# Altium project HV_DAC_1PPM.PrjPcb (part 1 of 3)
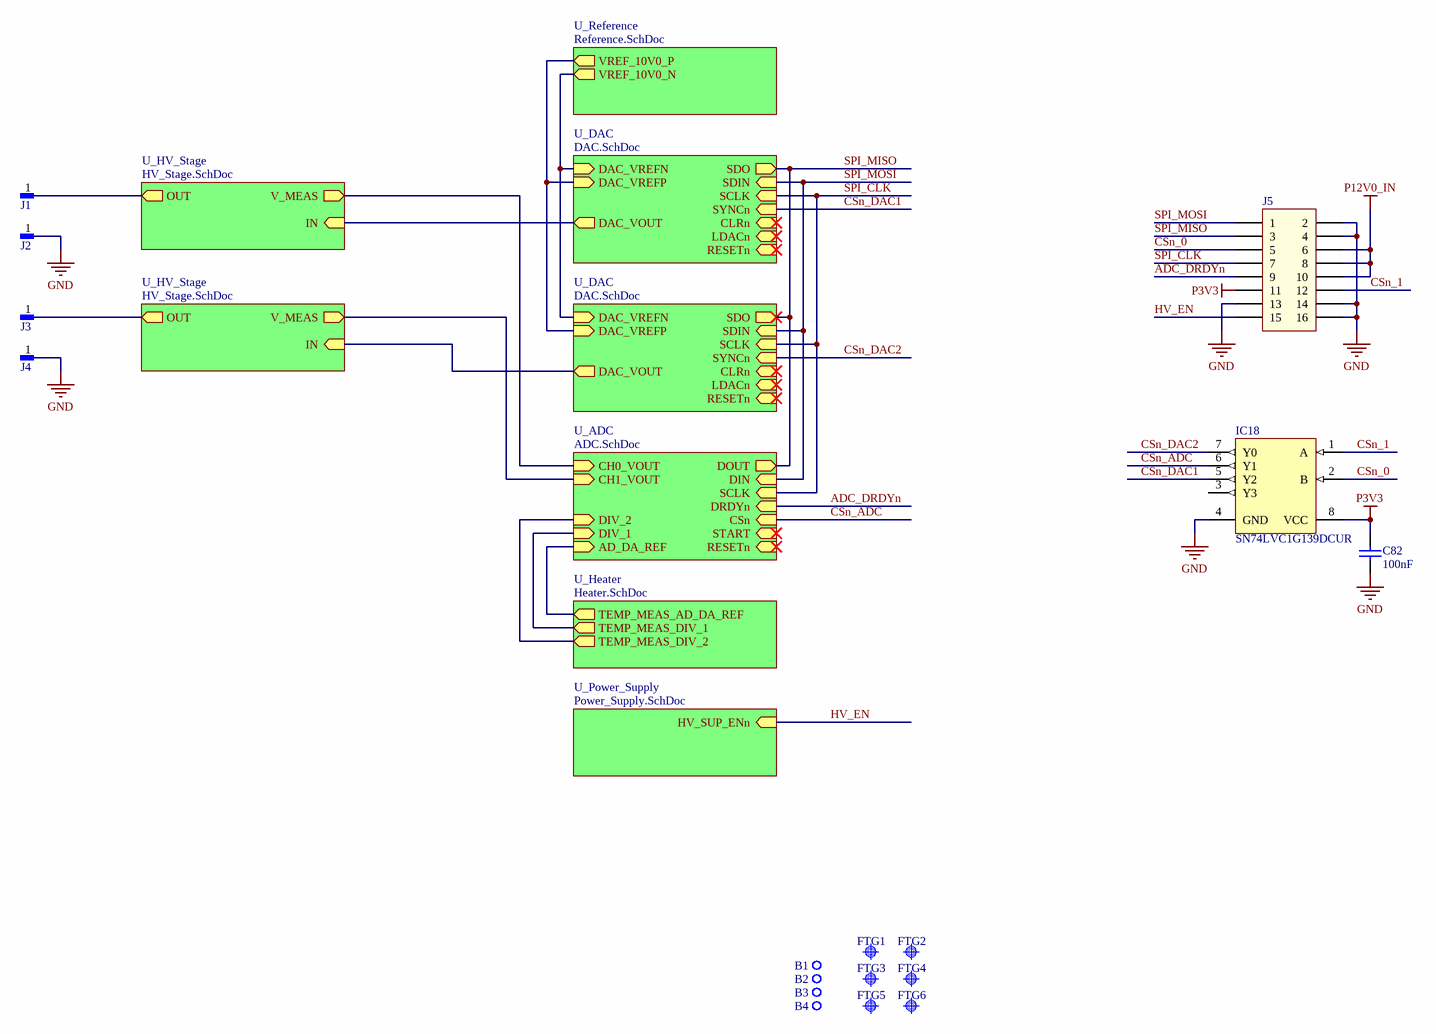
[diagram p0: HV_DAC_1PPM.SchDoc]
revision: 1.0
7 sheets, 392 parts. Net scope: hierarchical (ports join the sheet entries above them; power ports are global).
Board file: HV_DAC_1PPM.PcbDoc
Sheets:
  HV_DAC_1PPM.SchDoc
    U_ADC = ADC.SchDoc
    U_DAC = DAC.SchDoc
    U_Heater = Heater.SchDoc
    U_Power_Supply = Power_Supply.SchDoc
    U_Reference = Reference.SchDoc
    U_HV_Stage = HV_Stage.SchDoc
    U_HV_Stage = HV_Stage.SchDoc
    U_DAC = DAC.SchDoc

## Sheet HV_DAC_1PPM.SchDoc: HV DAC 1ppm
size A3; Author: M.Beldyga; CompanyName: WUT ISE; DrawnBy: M.Beldyga; Organization: WUT ISE; Address1: PW ISE; Address2: Nowowiejska 15/19 00-665 Warsaw; Address3: micbeldyga@gmail.com; SheetNumber: 1; SheetTotal: 7; ModifiedBy: -; CheckedDate: -; DivGrp: WUT ISE; Designer: M.Beldyga; ModifiedDate: -; ProjectName: Sensor Box

### Parts
B1  Plated Hole  [MTG270_500]  (value not drawn)  (no BOM)
B2  Plated Hole  [MTG270_500]  (value not drawn)  (no BOM)
B3  Plated Hole  [MTG270_500]  (value not drawn)  (no BOM)
B4  Plated Hole  [MTG270_500]  (value not drawn)  (no BOM)
C82  100nF  [CAPC1005X55N]
FTG1  Use only in PCB  [FIDUCIAL_TOP_S100-200]  (value not drawn)  (no BOM)
FTG2  Use only in PCB  [FIDUCIAL_TOP_S100-200]  (value not drawn)  (no BOM)
FTG3  Use only in PCB  [FIDUCIAL_TOP_S100-200]  (value not drawn)  (no BOM)
FTG4  Use only in PCB  [FIDUCIAL_TOP_S100-200]  (value not drawn)  (no BOM)
FTG5  Use only in PCB  [FIDUCIAL_TOP_S100-200]  (value not drawn)  (no BOM)
FTG6  Use only in PCB  [FIDUCIAL_TOP_S100-200]  (value not drawn)  (no BOM)
IC18  SN74LVC1G139DCUR  [TSSOP50P310X90-8N]
J1  SMD Pad  [R400X300]  (value not drawn)
J2  SMD Pad  [R400X300]  (value not drawn)
J3  SMD Pad  [R400X300]  (value not drawn)
J4  SMD Pad  [R400X300]  (value not drawn)
J5  2.00 mm_SMT_Vertical_16 pin  [62131621821]  (value not drawn)

### Sub-sheets
U_ADC = ADC.SchDoc: SCLK (in), DIN (in), DRDYn (in), DOUT (out), CSn (in), START (in), RESETn (in), CH0_VOUT (in), CH1_VOUT (in), AD_DA_REF (in), DIV_1 (in), DIV_2 (in)
U_DAC = DAC.SchDoc: SDIN (in), SCLK (in), SYNCn (in), SDO (out), CLRn (in), LDACn (in), RESETn (in), DAC_VREFN (in), DAC_VREFP (in), DAC_VOUT (out)
U_DAC = DAC.SchDoc: SDIN (in), SCLK (in), SYNCn (in), SDO (out), CLRn (in), LDACn (in), RESETn (in), DAC_VREFN (in), DAC_VREFP (in), DAC_VOUT (out)
U_Heater = Heater.SchDoc: TEMP_MEAS_AD_DA_REF (out), TEMP_MEAS_DIV_1 (out), TEMP_MEAS_DIV_2 (out)
U_HV_Stage = HV_Stage.SchDoc: IN (in), OUT (out), V_MEAS (out)
U_HV_Stage = HV_Stage.SchDoc: IN (in), OUT (out), V_MEAS (out)
U_Power_Supply = Power_Supply.SchDoc: HV_SUP_ENn (in)
U_Reference = Reference.SchDoc: VREF_10V0_P (out), VREF_10V0_N (out)

### Nets
GND: C82.1 IC18.4(GND) J2.1 J4.1 J5.2 J5.4 J5.13 J5.14 J5.16
P3V3: C82.2 IC18.8(VCC) J5.11
P12V0_IN: J5.6 J5.8 J5.10
ADC_AIN0: sheet U_ADC/DIV_1, sheet U_Heater/TEMP_MEAS_DIV_1
ADC_AIN1: sheet U_ADC/CH1_VOUT, sheet U_HV_Stage/V_MEAS
ADC_AIN4: sheet U_ADC/CH0_VOUT, sheet U_HV_Stage/V_MEAS
ADC_AIN5: sheet U_ADC/AD_DA_REF, sheet U_Heater/TEMP_MEAS_AD_DA_REF
ADC_AIN6: sheet U_ADC/DIV_2, sheet U_Heater/TEMP_MEAS_DIV_2
ADC_DRDYn: J5.9 ; sheet U_ADC/DRDYn
CSn_0: IC18.2(B) J5.5
CSn_1: IC18.1(A) J5.12
CSn_ADC: IC18.6(Y1) ; sheet U_ADC/CSn
CSn_DAC1: IC18.5(Y2) ; sheet U_DAC/SYNCn
CSn_DAC2: IC18.7(Y0) ; sheet U_DAC/SYNCn
DAC_RFB: sheet U_DAC/DAC_VOUT, sheet U_HV_Stage/IN
DAC_RFB: sheet U_HV_Stage/IN, sheet U_DAC/DAC_VOUT  [a separate net that carries the same name]
HV_EN: J5.15 ; sheet U_Power_Supply/HV_SUP_ENn
HV_OUT: J1.1 ; sheet U_HV_Stage/OUT
HV_OUT: J3.1 ; sheet U_HV_Stage/OUT  [a separate net that carries the same name]
SPI_CLK: J5.7 ; sheet U_ADC/SCLK, sheet U_DAC/SCLK, sheet U_DAC/SCLK
SPI_MISO: J5.3 ; sheet U_ADC/DOUT, sheet U_DAC/SDO, sheet U_DAC/SDO
SPI_MOSI: J5.1 ; sheet U_ADC/DIN, sheet U_DAC/SDIN, sheet U_DAC/SDIN
VREF_10V0_N: sheet U_DAC/DAC_VREFN, sheet U_Reference/VREF_10V0_N, sheet U_DAC/DAC_VREFN
VREF_10V0_P: sheet U_DAC/DAC_VREFP, sheet U_Reference/VREF_10V0_P, sheet U_DAC/DAC_VREFP

Not connected (* = marked no-connect by the designer): B1 1; B2 1; B3 1; B4 1; IC18 3(Y3)

### Notes on the sheet
- Project/Equipment
- Document
- Designer
- Drawn by
- Check.by
- Contact
- File
- Last Mod.
- Print Date
- Sheet
- Size
- A3
- of
- Rev

### Library data of the parts
B1-B4 = PLATED_HOLE2.7_PAD5.0: Single Terminal Socket; Part Description: Plated Through Hole: Hole Dia.=2.7mm Pad Dia.=5.0mm; Mounted: No; Part Number: PLATED_HOLE2.7_PAD5.0; Component Type: Standard (No BOM); Pin Count: 1; Family: Plated Hole; Socket: No; SMD: No; Sense: No; Status: None; ComponentHeight: 0mm; HelpURL: Undefined; Author: CERN DEM JMW; CreateDate: 27.09.2011; LatestRevisionDate: 27.09.2011; PackageDescription: Plated Through Hole: Hole Dia.=2.7mm Pad Dia.=5.0mm
C82 = CC0402_100NF_50V_10%_X7R: Non-polarised capacitor; Part Description: SMD Multilayer Chip Ceramic Capacitor; Manufacturer: GENERIC; Manufacturer1 Part Number: GRM155R71H104KE14D; Voltage: 50V; TC: X7R; Tolerance: ±10%; Part Number: CC0402_100NF_50V_10%_X7R; Component Kind: Standard; Component Type: Standard; Pin Count: 2; Value: 100nF; Status: None; Manufacturer Part Number: CC0402_100NF_50V_10%_X7R; Case: 0402; Mounted: Yes; Socket: No; SMD: Yes; Sense: No; Manufacturer1 Example: MURATA; Manufacturer1 ComponentHeight: 0.55mm; HelpURL: \\cern.ch\dfs\Applications\Altium\Datasheets\CC0402_MURATA_GRM155R71H104KE14D.pdf; Author: CERN DEM MR; CreateDate: 6/30/2017; LatestRevisionDate: 6/30/2017
FTG1-FTG6 = FIDUCIAL_TARGET_S100-200: Fiducial Target; Part Description: Square Fiducial Target, Top Layer, 1.0mm, Top Solder 2.0mm, Keepout =2.0mm; Mounted: No; Part Number: FIDUCIAL_TARGET_S100-200; Component Type: Standard (No BOM); Pin Count: 1; Family: Fiducial; Socket: No; SMD: Yes; Sense: No; Status: None; ComponentHeight: 0mm; HelpURL: Undefined; Author: CERN DEM JLC; CreateDate: 09.02.2010; LatestRevisionDate: 04.04.2012; PackageDescription: Square Fiducial Target, Top Layer, 1.0mm, Top Solder 2.0mm, Keepout =2.0mm
IC18 = SN74LVC1G139DCUR: IC DECODER/DEMUX 1X2: 4 8VSSOP Decoder/Demultiplexer 1 x 2: 4 8-VSSOP; Manufacturer: Texas Instruments; Number of Outputs: 4; Number of Bits: 1; Logic Function: Decoder,Demultiplexer; Number of Inputs: 2; Propagation Delay: 16.7ns; Max Supply Voltage: 5.5V; Min Supply Voltage: 1.65V; High Level Output Current: 32mA; Polarity: Inverting; Quiescent Current: 10uA; Supply Type: Single; Throw Configuration: 4340Throw Configuration; Number of Channels: 1NUMBER; Supplier: Mouser; Supplier Part Number: 595-SN74LVC1G139DCUR; Manufacturer Part Number: SN74LVC1G139DCUR; RoHS: Yes; Category: Integrated Circuits (ICs); Stock: 29396; Pricing: 1=0.38, 10=0.261, 50=0.235, 100=0.207, 1000=0.178, 10000=0.158 (USD); Mounting Technology: Surface Mount; Case/Package: VSSOP; Pins: 8; Weight: 0.000339oz; Min Operating Temperature: -40°C; Max Operating Temperature: 85°C; Packaging: Tape and Reel; Number of Circuits: 1; Number of Elements: 1; Low Level Output Current: 32mA; Number of Input Lines: 2; Number of Output Lines: 4; Independent Circuits: 1; Series: 74LVC; Technology: CMOS; Length: 2.3mm; Width: 2mm; Height: 900um; Thickness: 850um; Reach SVHC Compliant: No; Lead Free: 5697LeadFree; RoHS Compliant: Yes; ComponentLink1URL: https://datasheet.ciiva.com/1888/sn74lvc1g139-1888859.pdf?src-supplier=Digikey; ComponentLink1Description: https://datasheet.ciiva.com/1888/sn74lvc1g139-1888859.pdf?src-supplier=Digikey; ComponentLink2URL: https://datasheet.ciiva.com/1888/sn74lvc1g139-1888860.pdf?src-supplier=Digikey; ComponentLink2Description: https://datasheet.ciiva.com/1888/sn74lvc1g139-1888860.pdf?src-supplier=Digikey; ComponentLink3URL: https://datasheet.ciiva.com/14293/sn74lvc1g139-14293589.pdf?src-supplier=Avnet; ComponentLink3Description: https://datasheet.ciiva.com/14293/sn74lvc1g139-14293589.pdf?src-supplier=Avnet; ComponentLink4URL: https://datasheet.ciiva.com/14294/sn74lvc1g139-14294935.pdf?src-supplier=Avnet; ComponentLink4Description: https://datasheet.ciiva.com/14294/sn74lvc1g139-14294935.pdf?src-supplier=Avnet; ComponentLink5URL: https://datasheet.ciiva.com/46430/1847422-46430989.pdf?src-supplier=Element14; ComponentLink5Description: https://datasheet.ciiva.com/46430/1847422-46430989.pdf?src-supplier=Element14
J1-J4 = SMD_PAD_4X3MM: Pad; Part Description: 4mm x 3mm SMD Pad; Mounted: No; Part Number: SMD_PAD_4X3MM; Component Kind: Standard (No BOM); Component Type: Standard (No BOM); Pin Count: 1; Family: SMD Pad; Socket: No; SMD: Yes; Sense: No; Status: None; ComponentHeight: 0mm; HelpURL: Undefined; Author: CERN DEM JLC; CreateDate: 3/15/2010; LatestRevisionDate: 3/15/2010; PackageDescription: 4mm x  3mm SMD Pad
J5 = 62131621821: Socket Header WR-PHD, Pitch 2.00 mm, SMT, Vertical, dual row, 16 pin; Rated Current: 2 A; Pin Number: 16; Pitch: 2.00 mm; Working Voltage: 200 VAC; Contact Resistance: 20 mOhm; Insulation Resistance: >1000 MOhm; ComponentLink1Description: Manufacturer; ComponentLink1URL: http://www.we-online.de; ComponentLink2Description: Datasheet; ComponentLink2URL: http://katalog.we-online.com/em/datasheet/62131621821.pdf; Part Number: 62131621821; Published Date: Jan. 2018; Publisher: Wurth Elektronik; Operating Temperature: -40 to 105 degC; Mounting Technology: SMT; Row Number: dual; Orientation: Vertical

## Sheet ADC.SchDoc: ADC
size A3; Author: M.Beldyga; CompanyName: WUT ISE; DrawnBy: M.Beldyga; Organization: WUT ISE; Address1: PW ISE; Address2: Nowowiejska 15/19 00-665 Warsaw; Address3: micbeldyga@gmail.com; SheetNumber: 4; SheetTotal: 7; ModifiedBy: -; CheckedDate: -; Title2: 2ksps 24b; DivGrp: WUT ISE; Designer: M.Beldyga; ModifiedDate: -; ProjectName: Sensor Box
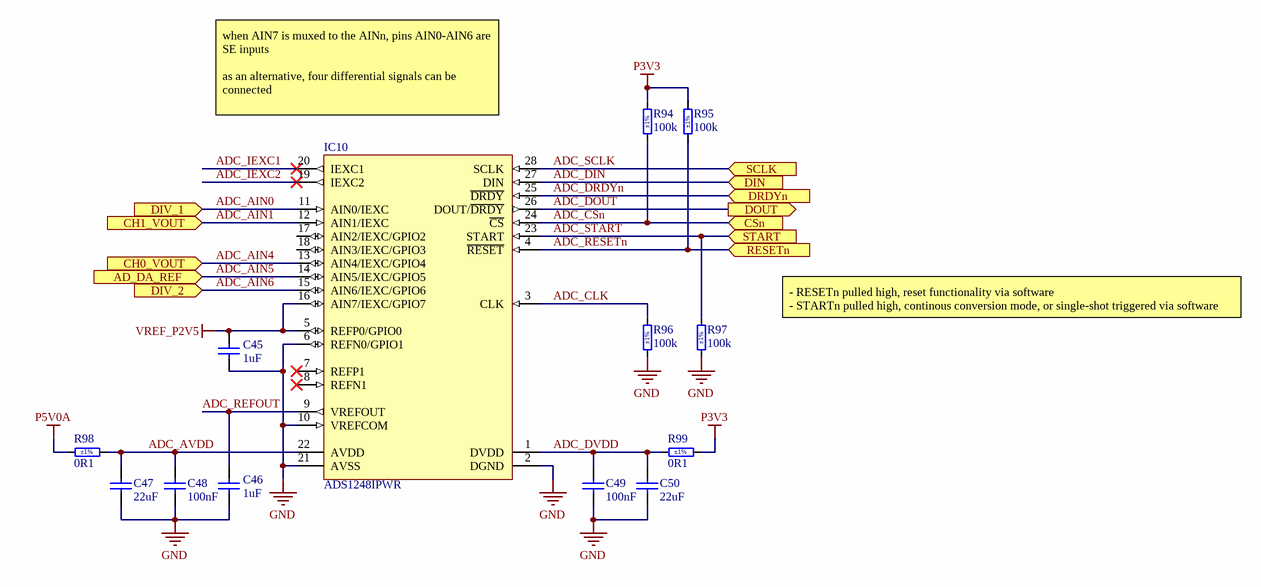
[diagram p1: ADC.SchDoc]

### Parts
C45  1uF  [CAPC1005X55N]
C46  1uF  [CAPC1005X55N]
C47  22uF  [CAPC3216X180N]
C48  100nF  [CAPC1005X55N]
C49  100nF  [CAPC1005X55N]
C50  22uF  [CAPC3216X180N]
IC10  ADS1248IPWR  [SOP65P640X120-28N]
R94  100k  Tolerance: ±1%  [RESC1005X40N]
R95  100k  Tolerance: ±1%  [RESC1005X40N]
R96  100k  Tolerance: ±1%  [RESC1005X40N]
R97  100k  Tolerance: ±1%  [RESC1005X40N]
R98  0R1  Tolerance: ±1%  [RESC1608X55N]
R99  0R1  Tolerance: ±1%  [RESC1608X55N]

### Ports
AD_DA_REF (in), CH0_VOUT (in), CH1_VOUT (in), CSn (in), DIN (in), DIV_1 (in), DIV_2 (in), DOUT (out), DRDYn (in), RESETn (in), SCLK (in), START (in)

### Nets
GND: C45.1 C46.1 C47.1 C48.1 C49.1 C50.1 IC10.2(DGND) IC10.6(REFN0/GPIO1) IC10.10(VREFCOM) IC10.21(AVSS) R96.1 R97.1
P3V3: R94.2 R95.2 R99.1
P5V0A: R98.2
VREF_P2V5: C45.2 IC10.5(REFP0/GPIO0) IC10.16(AIN7/IEXC/GPIO7)
ADC_AIN0: IC10.11(AIN0/IEXC) ; port DIV_1
ADC_AIN1: IC10.12(AIN1/IEXC) ; port CH1_VOUT
ADC_AIN4: IC10.13(AIN4/IEXC/GPIO4) ; port CH0_VOUT
ADC_AIN5: IC10.14(AIN5/IEXC/GPIO5) ; port AD_DA_REF
ADC_AIN6: IC10.15(AIN6/IEXC/GPIO6) ; port DIV_2
ADC_AVDD: C47.2 C48.2 IC10.22(AVDD) R98.1
ADC_CLK: IC10.3(CLK) R96.2
ADC_CSn: IC10.24(~{CS}) R94.1 ; port CSn  [project net CSn_ADC]
ADC_DIN: IC10.27(DIN) ; port DIN  [project net SPI_MOSI]
ADC_DOUT: IC10.26(DOUT/~{DRDY}) ; port DOUT  [project net SPI_MISO]
ADC_DRDYn: IC10.25(~{DRDY}) ; port DRDYn
ADC_DVDD: C49.2 C50.2 IC10.1(DVDD) R99.2
ADC_IEXC1: IC10.20(IEXC1)
ADC_IEXC2: IC10.19(IEXC2)
ADC_REFOUT: C46.2 IC10.9(VREFOUT)
ADC_RESETn: IC10.4(~{RESET}) R95.1 ; port RESETn
ADC_SCLK: IC10.28(SCLK) ; port SCLK  [project net SPI_CLK]
ADC_START: IC10.23(START) R97.2 ; port START

Not connected (* = marked no-connect by the designer): IC10 7(REFP1)* 8(REFN1)* 17(AIN2/IEXC/GPIO2) 18(AIN3/IEXC/GPIO3)

### Notes on the sheet
- when AIN7 is muxed to the AINn, pins AIN0-AIN6 are SE inputs
  as an alternative, four differential signals can be connected
- - RESETn pulled high, reset functionality via software
  - STARTn pulled high, continous conversion mode, or single-shot triggered via software
- Project/Equipment
- Document
- Designer
- Drawn by
- Check.by
- Contact
- File
- Last Mod.
- Print Date
- Sheet
- Size
- A3
- of
- Rev

### Library data of the parts
C45 C46 = CC0402_1UF_16V_10%_X5R: Non-polarised capacitor; Part Description: SMD Multilayer Chip Ceramic Capacitor; Manufacturer: GENERIC; Manufacturer1 Part Number: C1005X5R1C105KT; Voltage: 16V; TC: X5R; Tolerance: ±10%; Part Number: CC0402_1UF_16V_10%_X5R; Component Kind: Standard; Component Type: Standard; Pin Count: 2; Value: 1uF; Status: Preferred; Manufacturer Part Number: CC0402_1UF_16V_10%_X5R; Case: 0402; Mounted: Yes; Socket: No; SMD: Yes; Sense: No; Manufacturer1 Example: TDK; Manufacturer1 ComponentHeight: 0.55mm; HelpURL: \\cern.ch\dfs\Applications\Altium\Datasheets\CC0402_X5R_TDK_C.pdf; Author: CERN DEM JLC; CreateDate: 25.10.2012; LatestRevisionDate: 25.10.2012
C47 C50 = CC1206_22UF_25V_20%_X5R: Non-polarised capacitor; Part Description: SMD Multilayer Chip Ceramic Capacitor; Manufacturer: GENERIC; Manufacturer1 Part Number: C3216X5R1E226M160; Voltage: 25V; TC: X5R; Tolerance: ±20%; Part Number: CC1206_22UF_25V_20%_X5R; Component Kind: Standard; Component Type: Standard; Pin Count: 2; Value: 22uF; Status: None; Manufacturer Part Number: CC1206_22UF_25V_20%_X5R; Case: 1206; Mounted: Yes; Socket: No; SMD: Yes; Sense: No; Manufacturer1 Example: TDK; Manufacturer1 ComponentHeight: 1.8mm; HelpURL: \\cern.ch\dfs\Applications\Altium\Datasheets\CC1206_X5R_TDK_C.pdf; Author: CERN DEM WB; CreateDate: 7/25/2018; LatestRevisionDate: 7/25/2018
C48 C49 = CC0402_100NF_50V_10%_X7R: as C82 on sheet HV_DAC_1PPM; Part Number: CC0402_100NF_50V_10%_X7R; Component Kind: Standard; Component Type: Standard; Pin Count: 2; Value: 100nF; Status: None; Manufacturer Part Number: CC0402_100NF_50V_10%_X7R; Case: 0402; Mounted: Yes; Socket: No; SMD: Yes; Sense: No; Manufacturer1 Example: MURATA; Manufacturer1 ComponentHeight: 0.55mm; HelpURL: \\cern.ch\dfs\Applications\Altium\Datasheets\CC0402_MURATA_GRM155R71H104KE14D.pdf; Author: CERN DEM MR; CreateDate: 6/30/2017; LatestRevisionDate: 6/30/2017
IC10 = ADS1248IPWR: 24-Bit Analog-to-Digital Converter for Temperature Sensors; Manufacturer: TEXAS INSTRUMENTS; PressFit: No; Bonding: No; Part Number: ADS1248IPWR; Component Kind: Standard; Component Type: Standard; Device: ADS1248IPWR; PackageDescription: SOP, 0.65mm Pitch; 28 Pin, 4.40mm W X 9.70mm L X 1.20mm H body, IPC Medium Density; Part Description: 24-Bit Analog-to-Digital Converter for Temperature Sensors; Manufacturer Part Number: ADS1248IPWR; Pin Count: 28; Case: TSSOP28; Mounted: Yes; Socket: No; SMD: Yes; Sense: No; ComponentHeight: 1.2mm; Author: CERN DEM JLC; HelpURL: \\cern.ch\dfs\Applications\Altium\Datasheets\ADS1248IPWR.pdf; CreateDate: 3/19/2012; LatestRevisionDate: 3/19/2012
R94-R97 = R0402_100K_1%_0.0625W_100PPM: Resistor - 1%; Part Description: General Purpose Thick Film Chip Resistor; Manufacturer: GENERIC; Manufacturer1 Part Number: 232270671004L; TC: ±100ppm/°C; PressFit: No; Part Number: R0402_100K_1%_0.0625W_100PPM; Component Kind: Standard; Component Type: Standard; Pin Count: 2; Value: 100k; Status: Not Recommended; Power: 0.0625W; Manufacturer Part Number: R0402_100K_1%_0.0625W_100PPM; Case: 0402; Mounted: Yes; Sense: No; Socket: No; SMD: Yes; Manufacturer1 Example: YAGEO PHYCOMP; Manufacturer1 ComponentHeight: 0.4mm; HelpURL: \\cern.ch\dfs\Applications\Altium\Datasheets\R0402_Phycomp_RC0402.pdf; Author: CERN DEM JLC; CreateDate: 12/3/2007; LatestRevisionDate: 10/17/2012
R98 R99 = R0603_0R1_1%_0.1W_200PPM: Resistor - 1%; Part Description: Low Value Chip Resistor; Manufacturer: GENERIC; Manufacturer1 Part Number: CRL0603-FW-R100ELF; Power: 0.1W; TC: ±200ppm/°C; PressFit: No; Part Number: R0603_0R1_1%_0.1W_200PPM; Component Kind: Standard; Component Type: Standard; Pin Count: 2; Value: 0R1; Status: Preferred; Manufacturer Part Number: R0603_0R1_1%_0.1W_200PPM; Case: 0603; Mounted: Yes; Sense: No; Socket: No; SMD: Yes; Manufacturer1 Example: BOURNS; Manufacturer1 ComponentHeight: 0.55mm; HelpURL: \\cern.ch\dfs\Applications\Altium\Datasheets\R0603_BOURNS_CRL.pdf; Author: CERN DEM JMW; CreateDate: 11/26/2019; LatestRevisionDate: 11/26/2019

## Sheet DAC.SchDoc: DAC
size A3; Author: M.Beldyga; CompanyName: WUT ISE; DrawnBy: M.Beldyga; Organization: WUT ISE; Address1: PW ISE; Address2: Nowowiejska 15/19 00-665 Warsaw; Address3: micbeldyga@gmail.com; SheetNumber: 6; SheetTotal: 7; ModifiedBy: -; CheckedDate: -; Title2: 1 ppm 20b; DivGrp: WUT ISE; Designer: M.Beldyga; ModifiedDate: -; ProjectName: Sensor Box
Used 2 times, as channels U_DAC, U_DAC. Parts and nets are listed once, with the designators drawn on the sheet.
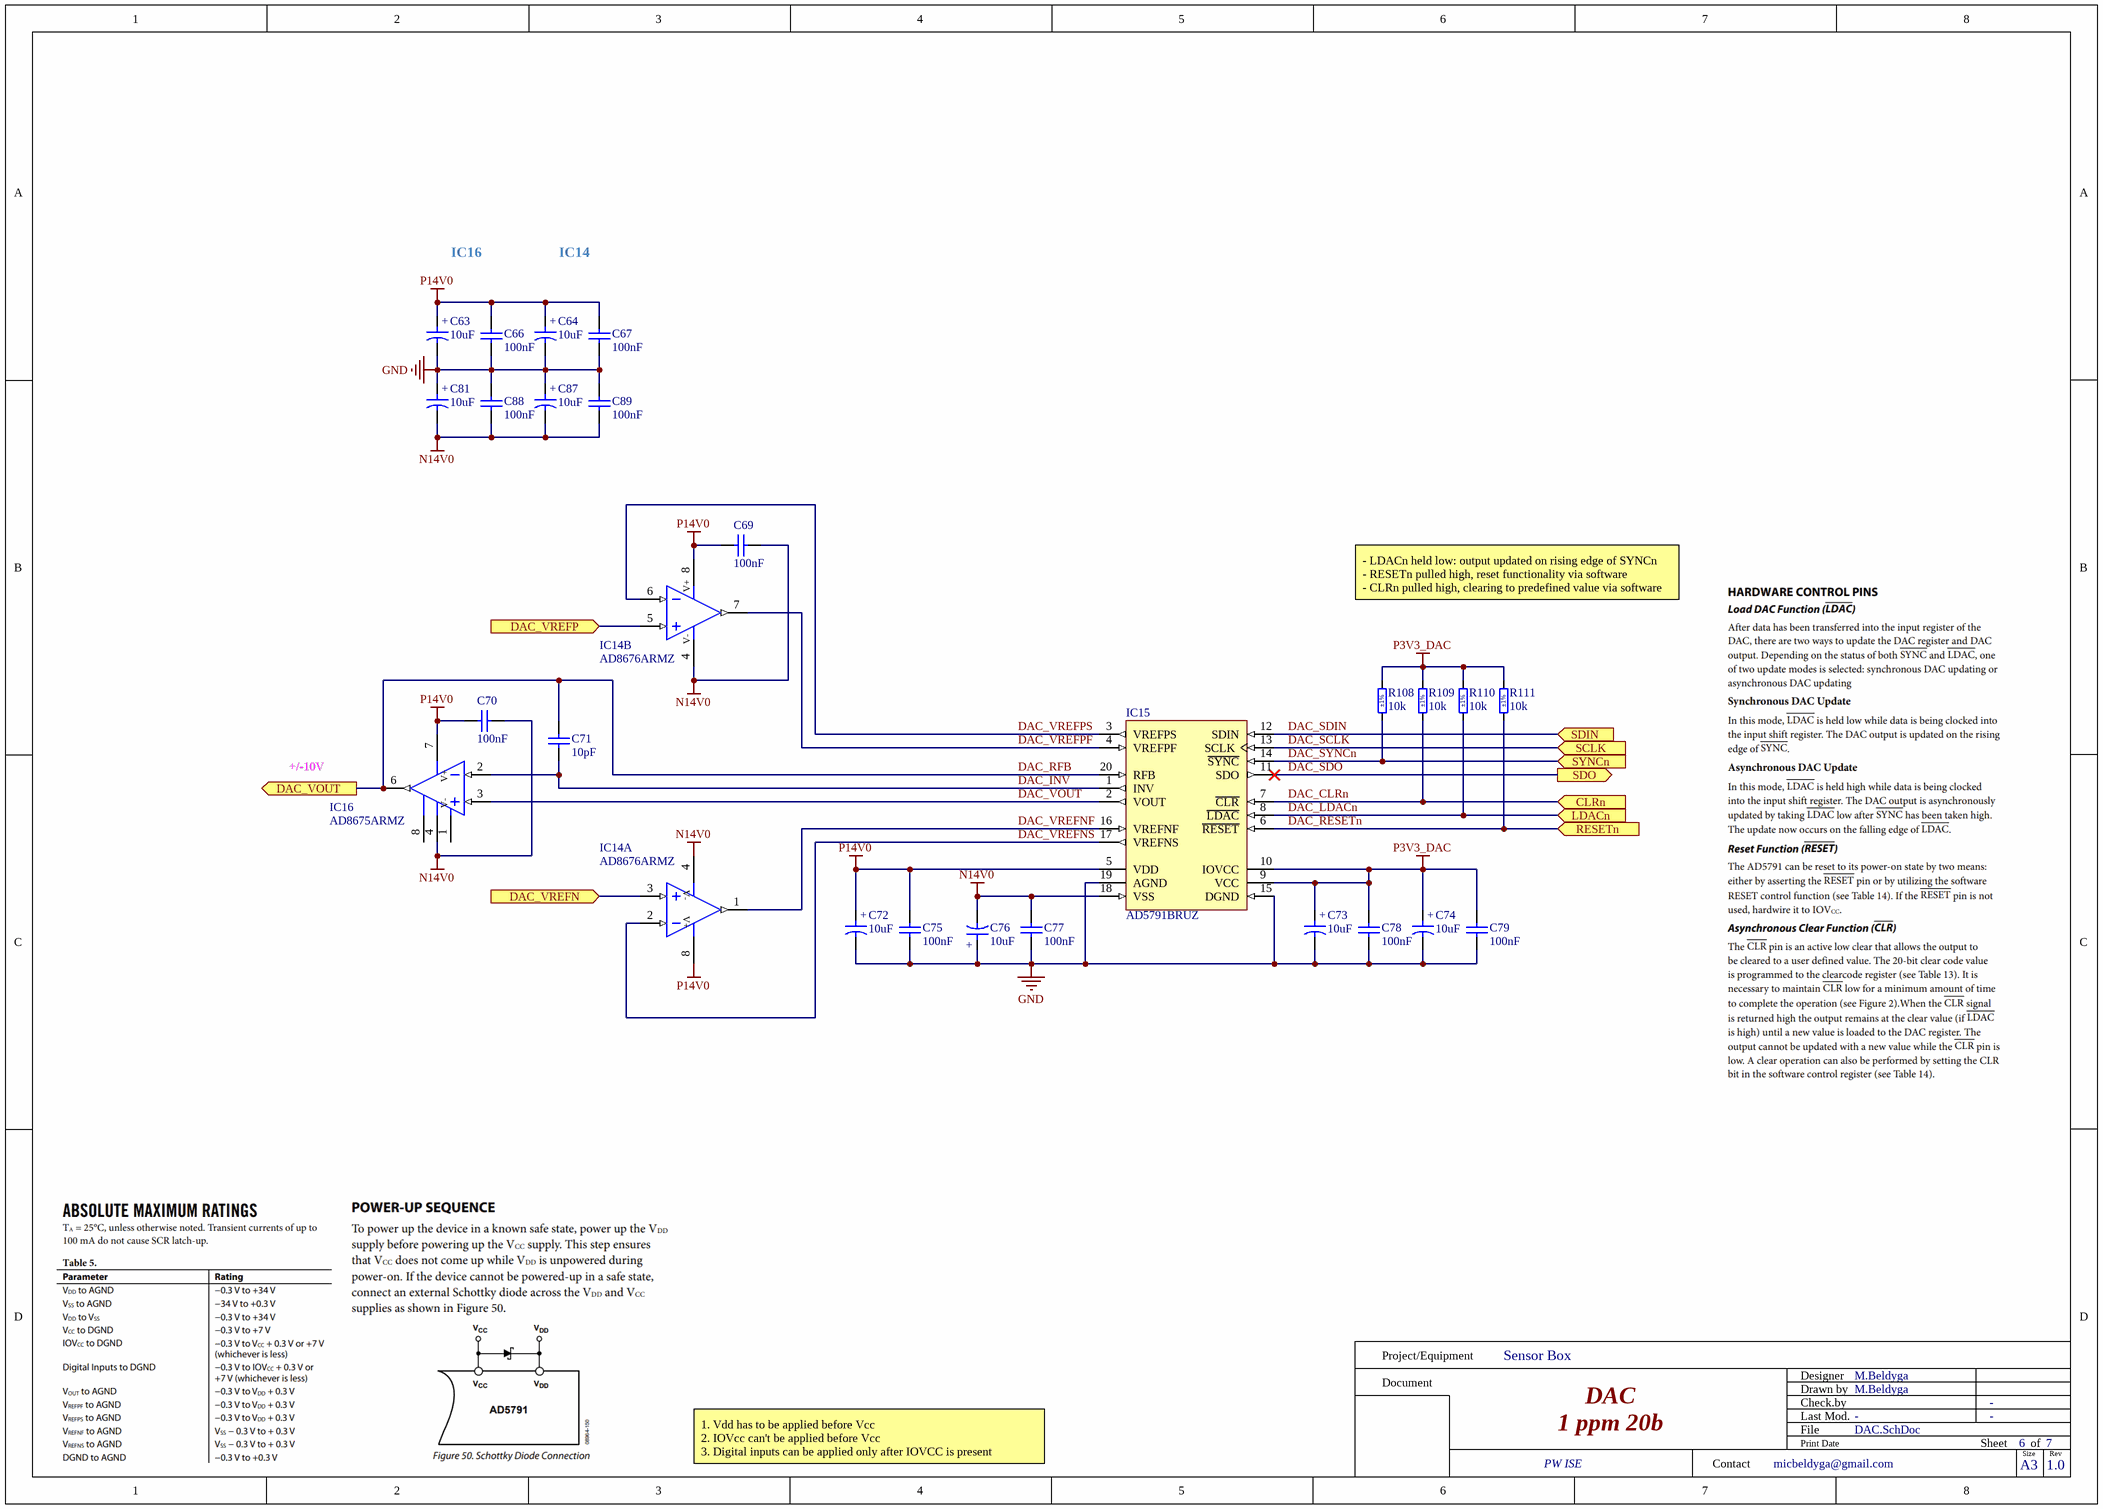
[diagram p2: DAC.SchDoc]

### Parts
C63  10uF  [CAPMP3216X180N]
C64  10uF  [CAPMP3216X180N]
C66  100nF  [CAPC1005X55N]
C67  100nF  [CAPC1005X55N]
C69  100nF  [CAPC1005X55N]
C70  100nF  [CAPC1005X55N]
C71  10pF  [CAPC1005X55N]
C72  10uF  [CAPMP3216X180N]
C73  10uF  [CAPMP3216X180N]
C74  10uF  [CAPMP3216X180N]
C75  100nF  [CAPC1005X55N]
C76  10uF  [CAPMP3216X180N]
C77  100nF  [CAPC1005X55N]
C78  100nF  [CAPC1005X55N]
C79  100nF  [CAPC1005X55N]
C81  10uF  [CAPMP3216X180N]
C87  10uF  [CAPMP3216X180N]
C88  100nF  [CAPC1005X55N]
C89  100nF  [CAPC1005X55N]
IC14  AD8676ARMZ  [SOP65P490X110-8N]  (parts A,B of 2)
IC15  AD5791BRUZ  [SOP65P640X120-20N]
IC16  AD8675ARMZ  [SOP65P490X110-8N]
R108  10k  Tolerance: ±1%  [RESC1005X40N]
R109  10k  Tolerance: ±1%  [RESC1005X40N]
R110  10k  Tolerance: ±1%  [RESC1005X40N]
R111  10k  Tolerance: ±1%  [RESC1005X40N]

### Ports
CLRn (in), DAC_VOUT (out), DAC_VREFN (in), DAC_VREFP (in), LDACn (in), RESETn (in), SCLK (in), SDIN (in), SDO (out), SYNCn (in)

### Nets
GND: C63.2 C64.2 C66.1 C67.1 C72.2 C73.2 C74.2 C75.1 C76.1 C77.1 C78.1 C79.1 C81.1 C87.1 C88.2 C89.2 IC15.15(DGND) IC15.19(AGND)
N14V0: C69.1 C70.1 C76.2 C77.2 C81.2 C87.2 C88.1 C89.1 IC14.4(V-) IC15.18(VSS) IC16.4(V-)
P3V3_DAC: C73.1 C74.1 C78.2 C79.2 IC15.9(VCC) IC15.10(IOVCC) R108.2 R109.2 R110.2 R111.2
P14V0: C63.1 C64.1 C66.2 C67.2 C69.2 C70.2 C72.1 C75.2 IC14.8(V+) IC15.5(VDD) IC16.7(V+)
DAC_CLRn: IC15.7(~{CLR}) R109.1 ; port CLRn
DAC_INV: C71.1 IC15.1(INV) IC16.2(IN-)
DAC_LDACn: IC15.8(~{LDAC}) R110.1 ; port LDACn
DAC_RESETn: IC15.6(~{RESET}) R111.1 ; port RESETn
DAC_RFB: C71.2 IC15.20(RFB) IC16.6(OUT) ; port DAC_VOUT
DAC_SCLK: IC15.13(SCLK) ; port SCLK
DAC_SDIN: IC15.12(SDIN) ; port SDIN
DAC_SDO: IC15.11(SDO) ; port SDO
DAC_SYNCn: IC15.14(~{SYNC}) R108.1 ; port SYNCn
DAC_VOUT: IC15.2(VOUT) IC16.3(IN+)
DAC_VREFN: IC14.3(IN+) ; port DAC_VREFN
DAC_VREFNF: IC14.1(OUT) IC15.16(VREFNF)
DAC_VREFNS: IC14.2(IN-) IC15.17(VREFNS)
DAC_VREFP: IC14.5(IN+) ; port DAC_VREFP
DAC_VREFPF: IC14.7(OUT) IC15.4(VREFPF)
DAC_VREFPS: IC14.6(IN-) IC15.3(VREFPS)

Not connected (* = marked no-connect by the designer): IC16 1(OFFSET) 8(OFFSET)

### Channels
U_DAC: designators end in B; ports CLRn=DAC_CLRn_U_DAC DAC_VOUT=DAC_RFB DAC_VREFN=VREF_10V0_N DAC_VREFP=VREF_10V0_P LDACn=DAC_LDACn_U_DAC RESETn=DAC_RESETn_U_DAC SCLK=SPI_CLK SDIN=SPI_MOSI SDO=SPI_MISO SYNCn=CSn_DAC1
U_DAC: designators end in A; ports CLRn=DAC_CLRn_U_DAC DAC_VOUT=DAC_RFB DAC_VREFN=VREF_10V0_N DAC_VREFP=VREF_10V0_P LDACn=DAC_LDACn_U_DAC RESETn=DAC_RESETn_U_DAC SCLK=SPI_CLK SDIN=SPI_MOSI SDO=SPI_MISO SYNCn=CSn_DAC2

### Notes on the sheet
- IC16
- IC14
- - LDACn held low: output updated on rising edge of SYNCn
  - RESETn pulled high, reset functionality via software
  - CLRn pulled high, clearing to predefined value via software
- +/-10V
- 1. Vdd has to be applied before Vcc
  2. IOVcc can't be applied before Vcc
  3. Digital inputs can be applied only after IOVCC is present
- Project/Equipment
- Document
- Designer
- Drawn by
- Check.by
- Contact
- File
- Last Mod.
- Print Date
- Sheet
- Size
- A3
- of
- Rev
- (in symbol CTE3216-18_10UF_10V_10%_LESR1800) +

### Library data of the parts
C63 C64 C72-C74 C76 C81 C87 = CTE3216-18_10UF_10V_10%_LESR1800: Polarised capacitor; Part Description: Low ESR 1R8 Solid Tantalum Chip Capacitor; Manufacturer: GENERIC; Manufacturer1 Part Number: TPSA106K010R1800; Voltage: 10V; Tolerance: ±10%; Part Number: CTE3216-18_10UF_10V_10%_LESR1800; Component Kind: Standard; Component Type: Standard; Pin Count: 2; Value: 10uF; Status: Preferred; Manufacturer Part Number: CTE3216-18_10UF_10V_10%_LESR1800; Case: A; Mounted: Yes; Socket: No; SMD: Yes; Sense: No; Manufacturer1 Example: AVX; Manufacturer1 ComponentHeight: 1.8mm; HelpURL: \\cern.ch\dfs\Applications\Altium\Datasheets\CTE-LESR_AVX_TPS.pdf; Author: CERN DEM JLC; CreateDate: 5/5/2008; LatestRevisionDate: 1/20/2009
C66 C67 C69 C70 C75 C77-C79 C88 C89 = CC0402_100NF_50V_10%_X7R: as C82 on sheet HV_DAC_1PPM; Part Number: CC0402_100NF_50V_10%_X7R; Component Kind: Standard; Component Type: Standard; Pin Count: 2; Value: 100nF; Status: None; Manufacturer Part Number: CC0402_100NF_50V_10%_X7R; Case: 0402; Mounted: Yes; Socket: No; SMD: Yes; Sense: No; Manufacturer1 Example: MURATA; Manufacturer1 ComponentHeight: 0.55mm; HelpURL: \\cern.ch\dfs\Applications\Altium\Datasheets\CC0402_MURATA_GRM155R71H104KE14D.pdf; Author: CERN DEM MR; CreateDate: 6/30/2017; LatestRevisionDate: 6/30/2017
C71 = CC0402_10PF_50V_5%_C0G: Non-polarised capacitor; Part Description: SMD Multilayer Chip Ceramic Capacitor; Manufacturer: GENERIC; Manufacturer1 Part Number: C0402C100J5GACTU; Voltage: 50V; TC: C0G/NP0; Tolerance: ±5%; Part Number: CC0402_10PF_50V_5%_C0G; Component Kind: Standard; Component Type: Standard; Pin Count: 2; Value: 10pF; Status: Preferred; Manufacturer Part Number: CC0402_10PF_50V_5%_C0G; Case: 0402; Mounted: Yes; Socket: No; SMD: Yes; Sense: No; Manufacturer1 Example: KEMET; Manufacturer1 ComponentHeight: 0.55mm; HelpURL: \\cern.ch\dfs\Applications\Altium\Datasheets\CC0402_C0G_KEMET_(Commercial Grade).pdf; Author: CERN DEM JLC; CreateDate: 12/3/2007; LatestRevisionDate: 4/22/2015
IC14 = AD8676ARMZ: Dual Operational Amplifier; Part Description: Ultraprecision, 36 V, 2.8 nV/sqrt Hz Dual Rail-to-Rail Output Operational Amplifier; Manufacturer: ANALOG DEVICES; PressFit: No; Bonding: No; Part Number: AD8676ARMZ; Component Kind: Standard; Component Type: Standard; Device: AD8676ARMZ; PackageDescription: SOP, 0.65mm Pitch; 8 Pin, 3.00mm W X 3.00mm L X 1.10mm H body, IPC Medium Density; Manufacturer Part Number: AD8676ARM; Pin Count: 8; Case: MSOP8; Mounted: Yes; Socket: No; SMD: Yes; Sense: No; ComponentHeight: 1.1mm; Author: CERN DEM JLC; HelpURL: \\cern.ch\dfs\Applications\Altium\Datasheets\AD8676ARMZ.pdf; CreateDate: 12/17/2013; LatestRevisionDate: 3/31/2022
IC15 = AD5791BRUZ: 1 ppm 20-Bit, ±1 LSB INL, Voltage Output DAC; Manufacturer: ANALOG DEVICES; PressFit: No; Bonding: No; Part Number: AD5791BRUZ; Component Kind: Standard; Component Type: Standard; Device: AD5791BRUZ; PackageDescription: SOP, 0.65mm Pitch; 20 Pin, 4.40mm W X 6.50mm L X 1.20mm H body, IPC Medium Density; Part Description: 1 ppm 20-Bit, ±1 LSB INL, Voltage Output DAC; Manufacturer Part Number: AD5791BRU; Pin Count: 20; Case: TSSOP20; Mounted: Yes; Socket: No; SMD: Yes; Sense: No; ComponentHeight: 1.2mm; Author: CERN DEM JLC; HelpURL: \\cern.ch\dfs\Applications\Altium\Datasheets\AD5791BRUZ.pdf; CreateDate: 5/11/2011; LatestRevisionDate: 3/24/2022
IC16 = AD8675ARMZ: Operational Amplifier with Offset 1-8; Part Description: 36V Precision, 2.8nV/sqrt Hz Rail-to-Rail Output Operational Amplifier; Manufacturer: ANALOG DEVICES; PressFit: No; Bonding: No; Part Number: AD8675ARMZ; Component Kind: Standard; Component Type: Standard; Device: AD8675ARMZ; PackageDescription: SOP, 0.65mm Pitch; 8 Pin, 3.00mm W X 3.00mm L X 1.10mm H body, IPC Medium Density; Manufacturer Part Number: AD8675ARM; Pin Count: 8; Case: MSOP8; Mounted: Yes; Socket: No; SMD: Yes; Sense: No; ComponentHeight: 1.1mm; Author: CERN DEM JMW; HelpURL: \\cern.ch\dfs\Applications\Altium\Datasheets\AD8675ARMZ.pdf; CreateDate: 9/6/2011; LatestRevisionDate: 3/31/2022
R108-R111 = R0402_10K_1%_0.0625W_100PPM: Resistor - 1%; Part Description: General Purpose Thick Film Chip Resistor; Manufacturer: GENERIC; Manufacturer1 Part Number: 232270671003L; TC: ±100ppm/°C; PressFit: No; Part Number: R0402_10K_1%_0.0625W_100PPM; Component Kind: Standard; Component Type: Standard; Pin Count: 2; Value: 10k; Status: Not Recommended; Power: 0.0625W; Manufacturer Part Number: R0402_10K_1%_0.0625W_100PPM; Case: 0402; Mounted: Yes; Sense: No; Socket: No; SMD: Yes; Manufacturer1 Example: YAGEO PHYCOMP; Manufacturer1 ComponentHeight: 0.4mm; HelpURL: \\cern.ch\dfs\Applications\Altium\Datasheets\R0402_Phycomp_RC0402.pdf; Author: CERN DEM JLC; CreateDate: 12/3/2007; LatestRevisionDate: 10/17/2012

## Sheet Heater.SchDoc: Heater
size 420 x 297 mm; EDA_Number: ARTIQ; Projet: GPSDO; Author: K.Belewicz/M.Beldyga; CompanyName: WUT ISE; DrawnBy: K.Belewicz/M.Beldyga; Organization: WUT ISE; Address1: PW ISE; Address2: Nowowiejska 15/19 00-665 Warsaw; Address3: gkasprow@gmail.com; Revision: 1; SheetNumber: 3; SheetTotal: 7; ModifiedBy: -; CheckedDate: -; DivGrp: WUT ISE; Designer: G.Kasprowicz; ModifiedDate: -; ProjectName: Sensor Box
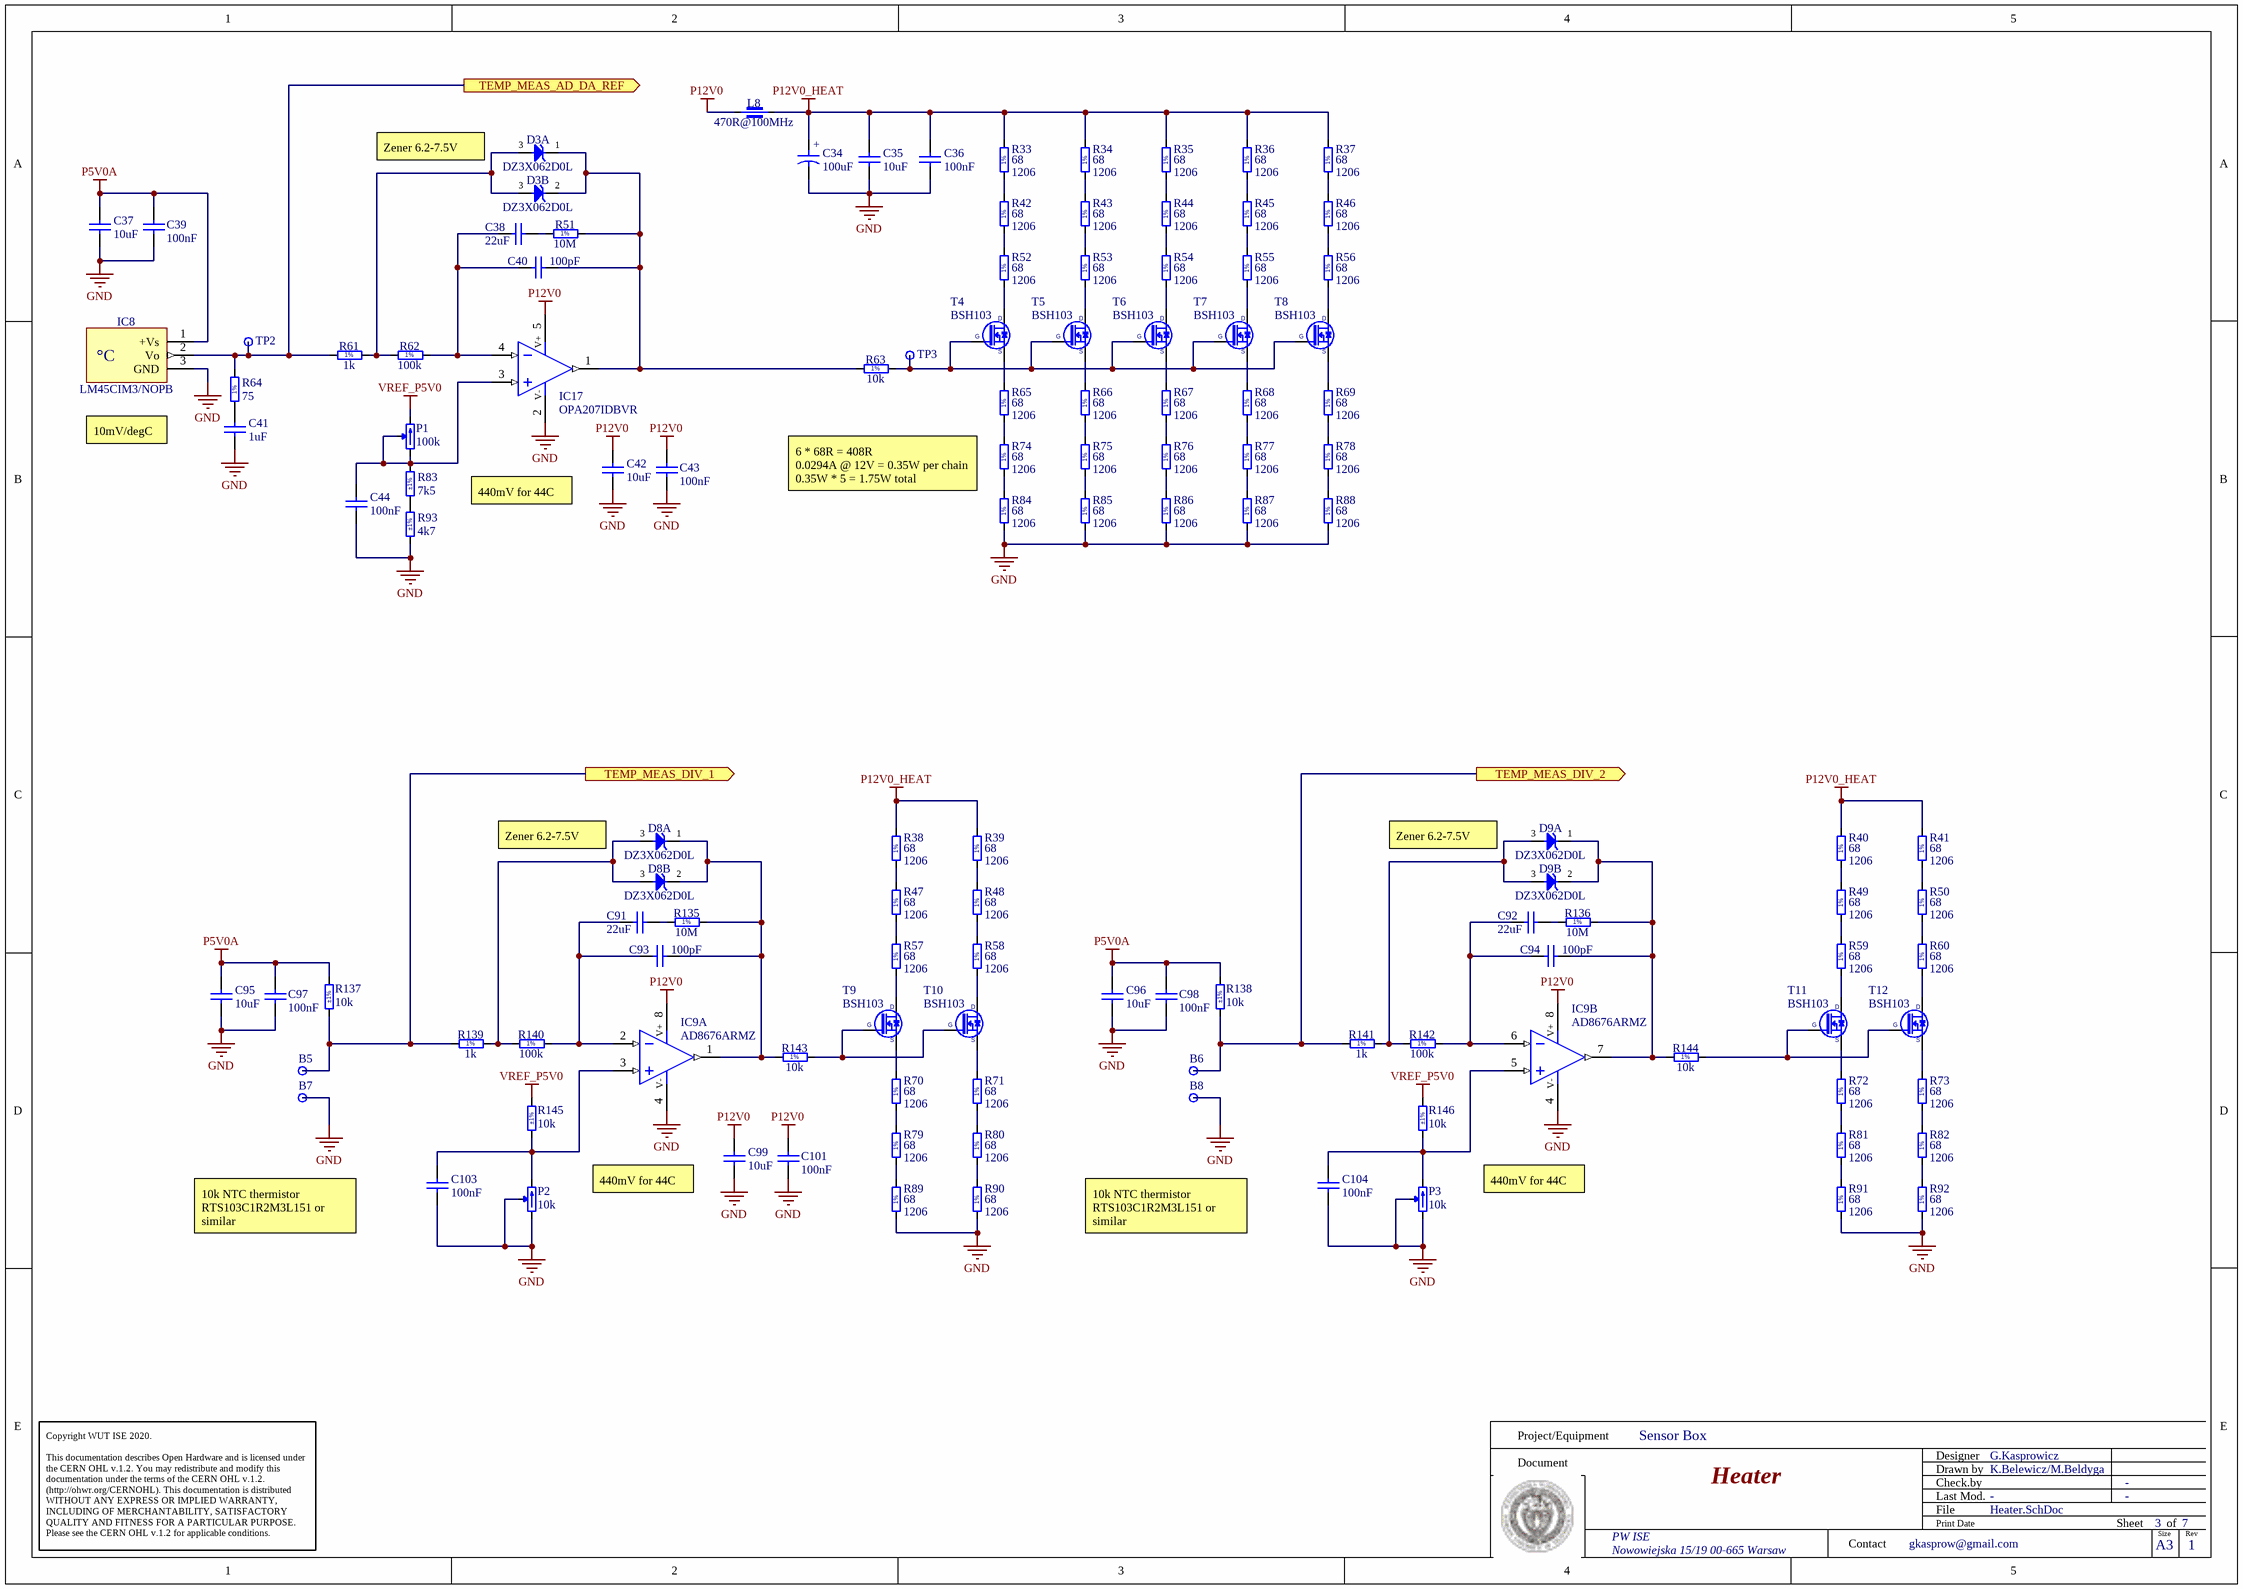
[diagram p3: Heater.SchDoc]

### Parts
B5  Plated Hole  [c150h80]  (value not drawn)  (no BOM)
B6  Plated Hole  [c150h80]  (value not drawn)  (no BOM)
B7  Plated Hole  [c150h80]  (value not drawn)  (no BOM)
B8  Plated Hole  [c150h80]  (value not drawn)  (no BOM)
C34  100uF  [CAPMP7343X310N]
C35  10uF  [CAPC1608X80N]
C36  100nF  [CAPC1005X55N]
C37  10uF  [CAPC1608X80N]
C38  22uF  [CAPC2012X135N]
C39  100nF  [CAPC1005X55N]
C40  100pF  [CAPC1005X55N]
C41  1uF  [CAPC1005X55N]
C42  10uF  [CAPC1608X80N]
C43  100nF  [CAPC1005X55N]
C44  100nF  [CAPC1005X55N]
C91  22uF  [CAPC2012X135N]
C92  22uF  [CAPC2012X135N]
C93  100pF  [CAPC1005X55N]
C94  100pF  [CAPC1005X55N]
C95  10uF  [CAPC1608X80N]
C96  10uF  [CAPC1608X80N]
C97  100nF  [CAPC1005X55N]
C98  100nF  [CAPC1005X55N]
C99  10uF  [CAPC1608X80N]
C101  100nF  [CAPC1005X55N]
C103  100nF  [CAPC1005X55N]
C104  100nF  [CAPC1005X55N]
D3  DZ3X062D0L  [SOT95P275X140-3N]  (parts A,B of 2)
D8  DZ3X062D0L  [SOT95P275X140-3N]  (parts A,B of 2)
D9  DZ3X062D0L  [SOT95P275X140-3N]  (parts A,B of 2)
IC8  LM45CIM3/NOPB  [SOT95P251X112-3N]
IC9  AD8676ARMZ  [SOP65P490X110-8N]  (parts A,B of 2)
IC17  OPA207IDBVR  [SOT95P280X145-5N]
L8  470R@100MHz  [INDC1608X95N]
P1  100k  [TRIM_BOURNS_3224X]
P2  10k  [TRIM_BOURNS_3224X]
P3  10k  [TRIM_BOURNS_3224X]
R33  68  Case: 1206  [RESC3216X65N]
R34  68  Case: 1206  [RESC3216X65N]
R35  68  Case: 1206  [RESC3216X65N]
R36  68  Case: 1206  [RESC3216X65N]
R37  68  Case: 1206  [RESC3216X65N]
R38  68  Case: 1206  [RESC3216X65N]
R39  68  Case: 1206  [RESC3216X65N]
R40  68  Case: 1206  [RESC3216X65N]
R41  68  Case: 1206  [RESC3216X65N]
R42  68  Case: 1206  [RESC3216X65N]
R43  68  Case: 1206  [RESC3216X65N]
R44  68  Case: 1206  [RESC3216X65N]
R45  68  Case: 1206  [RESC3216X65N]
R46  68  Case: 1206  [RESC3216X65N]
R47  68  Case: 1206  [RESC3216X65N]
R48  68  Case: 1206  [RESC3216X65N]
R49  68  Case: 1206  [RESC3216X65N]
R50  68  Case: 1206  [RESC3216X65N]
R51  10M  [RESC2113X55N]
R52  68  Case: 1206  [RESC3216X65N]
R53  68  Case: 1206  [RESC3216X65N]
R54  68  Case: 1206  [RESC3216X65N]
R55  68  Case: 1206  [RESC3216X65N]
R56  68  Case: 1206  [RESC3216X65N]
R57  68  Case: 1206  [RESC3216X65N]
R58  68  Case: 1206  [RESC3216X65N]
R59  68  Case: 1206  [RESC3216X65N]
R60  68  Case: 1206  [RESC3216X65N]
R61  1k  [RESC1005X40N]
R62  100k  [RESC1005X40N]
R63  10k  [RESC1005X40N]
R64  75  [RESC1005X40N]
R65  68  Case: 1206  [RESC3216X65N]
R66  68  Case: 1206  [RESC3216X65N]
R67  68  Case: 1206  [RESC3216X65N]
R68  68  Case: 1206  [RESC3216X65N]
R69  68  Case: 1206  [RESC3216X65N]
R70  68  Case: 1206  [RESC3216X65N]
R71  68  Case: 1206  [RESC3216X65N]
R72  68  Case: 1206  [RESC3216X65N]
R73  68  Case: 1206  [RESC3216X65N]
R74  68  Case: 1206  [RESC3216X65N]
R75  68  Case: 1206  [RESC3216X65N]
R76  68  Case: 1206  [RESC3216X65N]
R77  68  Case: 1206  [RESC3216X65N]
R78  68  Case: 1206  [RESC3216X65N]
R79  68  Case: 1206  [RESC3216X65N]
R80  68  Case: 1206  [RESC3216X65N]
R81  68  Case: 1206  [RESC3216X65N]
R82  68  Case: 1206  [RESC3216X65N]
R83  7k5  Tolerance: ±1%  [RESC1005X40N]
R84  68  Case: 1206  [RESC3216X65N]
R85  68  Case: 1206  [RESC3216X65N]
R86  68  Case: 1206  [RESC3216X65N]
R87  68  Case: 1206  [RESC3216X65N]
R88  68  Case: 1206  [RESC3216X65N]
R89  68  Case: 1206  [RESC3216X65N]
R90  68  Case: 1206  [RESC3216X65N]
R91  68  Case: 1206  [RESC3216X65N]
R92  68  Case: 1206  [RESC3216X65N]
R93  4k7  Tolerance: ±1%  [RESC1005X40N]
R135  10M  [RESC2113X55N]
R136  10M  [RESC2113X55N]
R137  10k  Tolerance: ±1%  [RESC1005X40N]
R138  10k  Tolerance: ±1%  [RESC1005X40N]
R139  1k  [RESC1005X40N]
R140  100k  [RESC1005X40N]
R141  1k  [RESC1005X40N]
R142  100k  [RESC1005X40N]
R143  10k  [RESC1005X40N]
R144  10k  [RESC1005X40N]
R145  10k  Tolerance: ±1%  [RESC1005X40N]
R146  10k  Tolerance: ±1%  [RESC1005X40N]
T4  BSH103  [SOT95P230X110-3N]
T5  BSH103  [SOT95P230X110-3N]
T6  BSH103  [SOT95P230X110-3N]
T7  BSH103  [SOT95P230X110-3N]
T8  BSH103  [SOT95P230X110-3N]
T9  BSH103  [SOT95P230X110-3N]
T10  BSH103  [SOT95P230X110-3N]
T11  BSH103  [SOT95P230X110-3N]
T12  BSH103  [SOT95P230X110-3N]
TP2  Test Point  [TPS127]  (value not drawn)  (no BOM)
TP3  Test Point  [TPS127]  (value not drawn)  (no BOM)

### Ports
TEMP_MEAS_AD_DA_REF (out), TEMP_MEAS_DIV_1 (out), TEMP_MEAS_DIV_2 (out)

### Nets
GND: B7.1 B8.1 C34.2 C35.1 C36.1 C37.1 C39.1 C41.1 C42.1 C43.1 C44.1 C95.1 C96.1 C97.1 C98.1 C99.1 C101.1 C103.1 C104.1 IC8.3(GND) IC9.4(V-) IC17.2(V-) P2.1(CCW) P2.2(W) P3.1(CCW) P3.2(W) R84.1 R85.1 R86.1 R87.1 R88.1 R89.1 R90.1 R91.1 R92.1 R93.1
P5V0A: C37.2 C39.2 C95.2 C96.2 C97.2 C98.2 IC8.1(+Vs) R137.2 R138.2
P12V0: C42.2 C43.2 C99.2 C101.2 IC9.8(V+) IC17.5(V+) L8.1
P12V0_HEAT: C34.1 C35.2 C36.2 L8.2 R33.2 R34.2 R35.2 R36.2 R37.2 R38.2 R39.2 R40.2 R41.2
VREF_P5V0: P1.3(CW) R145.2 R146.2
ADC_AIN0: B5.1 R137.1 R139.1 ; port TEMP_MEAS_DIV_1
ADC_AIN5: IC8.2(Vo) R61.1 R64.2 TP2.1 ; port TEMP_MEAS_AD_DA_REF
ADC_AIN6: B6.1 R138.1 R141.1 ; port TEMP_MEAS_DIV_2
NetC38_1: C38.1 C40.1 IC17.4(IN-) R62.2
NetC38_2: C38.2 R51.1
NetC40_2: C40.2 D3.1(C) D3.2(C) IC17.1(OUT) R51.2 R63.1
NetC41_2: C41.2 R64.1
NetC44_2: C44.2 IC17.3(IN+) P1.1(CCW) P1.2(W) R83.2
NetC91_1: C91.1 C93.1 IC9.2(IN-) R140.2
NetC91_2: C91.2 R135.1
NetC92_1: C92.1 C94.1 IC9.6(IN-) R142.2
NetC92_2: C92.2 R136.1
NetC93_2: C93.2 D8.1(C) D8.2(C) IC9.1(OUT) R135.2 R143.1
NetC94_2: C94.2 D9.1(C) D9.2(C) IC9.7(OUT) R136.2 R144.1
NetC103_2: C103.2 IC9.3(IN+) P2.3(CW) R145.1
NetC104_2: C104.2 IC9.5(IN+) P3.3(CW) R146.1
NetD3_3: D3.3(COMA) R61.2 R62.1
NetD8_3: D8.3(COMA) R139.2 R140.1
NetD9_3: D9.3(COMA) R141.2 R142.1
NetR33_1: R33.1 R42.2
NetR34_1: R34.1 R43.2
NetR35_1: R35.1 R44.2
NetR36_1: R36.1 R45.2
NetR37_1: R37.1 R46.2
NetR38_1: R38.1 R47.2
NetR39_1: R39.1 R48.2
NetR40_1: R40.1 R49.2
NetR41_1: R41.1 R50.2
NetR42_1: R42.1 R52.2
NetR43_1: R43.1 R53.2
NetR44_1: R44.1 R54.2
NetR45_1: R45.1 R55.2
NetR46_1: R46.1 R56.2
NetR47_1: R47.1 R57.2
NetR48_1: R48.1 R58.2
NetR49_1: R49.1 R59.2
NetR50_1: R50.1 R60.2
NetR52_1: R52.1 T4.3(D)
NetR53_1: R53.1 T5.3(D)
NetR54_1: R54.1 T6.3(D)
NetR55_1: R55.1 T7.3(D)
NetR56_1: R56.1 T8.3(D)
NetR57_1: R57.1 T9.3(D)
NetR58_1: R58.1 T10.3(D)
NetR59_1: R59.1 T11.3(D)
NetR60_1: R60.1 T12.3(D)
NetR63_2: R63.2 T4.1(G) T5.1(G) T6.1(G) T7.1(G) T8.1(G) TP3.1
NetR65_1: R65.1 R74.2
NetR65_2: R65.2 T4.2(S)
NetR66_1: R66.1 R75.2
NetR66_2: R66.2 T5.2(S)
NetR67_1: R67.1 R76.2
NetR67_2: R67.2 T6.2(S)
NetR68_1: R68.1 R77.2
NetR68_2: R68.2 T7.2(S)
NetR69_1: R69.1 R78.2
NetR69_2: R69.2 T8.2(S)
NetR70_1: R70.1 R79.2
NetR70_2: R70.2 T9.2(S)
NetR71_1: R71.1 R80.2
NetR71_2: R71.2 T10.2(S)
NetR72_1: R72.1 R81.2
NetR72_2: R72.2 T11.2(S)
NetR73_1: R73.1 R82.2
NetR73_2: R73.2 T12.2(S)
NetR74_1: R74.1 R84.2
NetR75_1: R75.1 R85.2
NetR76_1: R76.1 R86.2
NetR77_1: R77.1 R87.2
NetR78_1: R78.1 R88.2
NetR79_1: R79.1 R89.2
NetR80_1: R80.1 R90.2
NetR81_1: R81.1 R91.2
NetR82_1: R82.1 R92.2
NetR83_1: R83.1 R93.2
NetR143_2: R143.2 T9.1(G) T10.1(G)
NetR144_2: R144.2 T11.1(G) T12.1(G)

### Notes on the sheet
- (near D3) Zener 6.2-7.5V
- 10mV/degC
- 440mV for 44C
- 6 * 68R = 408R
  0.0294A @ 12V = 0.35W per chain
  0.35W * 5 = 1.75W total
- (near D8) Zener 6.2-7.5V
- (near D9) Zener 6.2-7.5V
- 10k NTC thermistor RTS103C1R2M3L151 or similar
- Project/Equipment
- Document
- Designer
- Drawn by
- Check.by
- Copyright WUT ISE 2020.
  This documentation describes Open Hardware and is licensed under the CERN OHL v.1.2. You may redistribute and modify this documentation under the terms of the CERN OHL v.1.2. (http://ohwr.org/CERNOHL). This documentation is distributed WITHOUT ANY EXPRESS OR IMPLIED WARRANTY, INCLUDING OF MERCHANTABILITY, SATISFACTORY QUALITY AND FITNESS FOR A PARTICULAR PURPOSE. Please see the CERN OHL v.1.2 for applicable conditions.
- Contact
- File
- Last Mod.
- Print Date
- Sheet
- Size
- A3
- of
- Rev
- (in symbol CTE7343-31_100UF_20V_10%) +
- (in symbol LM45CIM3/NOPB) °C
- (in symbol R0402_1k_1%_0.0625W_100PPM) 1%
- (in symbol R0402_10K_1%_0.0625W_100PPM) 1%
- (in symbol R0402_75R_1%_0.0625W_100PPM) 1%
- (in symbol R0402_100K_1%_0.0625W_100PPM) 1%
- (in symbol R0805_10M_1%_0.125W_100PPM_VISHAY_CRCW e3) 1%
- (in symbol R1206_68R_1%_0.25W_100PPM) 1%

### Library data of the parts
B5-B8 = PLATED_HOLE0.8_PAD1.5: Single Terminal Socket; Part Description: Plated Through Hole: Hole Dia.=0.8mm Pad Dia.=1.5mm, IPC-7251 Level A; Mounted: No; Part Number: PLATED_HOLE0.8_PAD1.5; Component Type: Standard (No BOM); Pin Count: 1; Family: Plated Hole; Socket: No; SMD: No; Sense: No; Status: None; ComponentHeight: 0mm; HelpURL: Undefined; Author: CERN DEM JLC; CreateDate: 5/11/2017; LatestRevisionDate: 5/11/2017; PackageDescription: Plated Through Hole: Hole Dia.=0.8mm Pad Dia.=1.3mm, IPC-7251 Level A
C34 = CTE7343-31_100UF_20V_10%: Polarised capacitor; Part Description: Solid Tantalum Chip Capacitor; Manufacturer: GENERIC; Manufacturer1 Part Number: TAJD107K020R; Voltage: 20V; Tolerance: ±10%; Part Number: CTE7343-31_100UF_20V_10%; Component Kind: Standard; Component Type: Standard; Pin Count: 2; Value: 100uF; Status: Preferred; Manufacturer Part Number: CTE7343-31_100UF_20V_10%; Case: D; Mounted: Yes; Socket: No; SMD: Yes; Sense: No; Manufacturer1 Example: AVX; Manufacturer1 ComponentHeight: 3.1mm; HelpURL: \\cern.ch\dfs\Applications\Altium\Datasheets\CTE_AVX_TAJ.pdf; Author: CERN DEM JLC; CreateDate: 03/12/2007; LatestRevisionDate: 03/12/2007
C35 C37 C42 C95 C96 C99 = CC0603_10UF_10V_10%_X5R: Non-polarised capacitor; Part Description: SMD Multilayer Chip Ceramic Capacitor; Manufacturer: GENERIC; Manufacturer1 Part Number: GRM188R61A106KE69D; Voltage: 10V; TC: X5R; Tolerance: ±10%; Part Number: CC0603_10UF_10V_10%_X5R; Component Kind: Standard; Component Type: Standard; Pin Count: 2; Value: 10uF; Status: None; Manufacturer Part Number: CC0603_10UF_10V_10%_X5R; Case: 0603; Mounted: Yes; Socket: No; SMD: Yes; Sense: No; Manufacturer1 Example: MURATA; Manufacturer1 ComponentHeight: 0.8mm; HelpURL: \\cern.ch\dfs\Applications\Altium\Datasheets\CC0603_MURATA_GRM188R61A106KE69D.pdf; Author: CERN DEM JLC; CreateDate: 31.01.2017; LatestRevisionDate: 31.01.2017
C36 C44 C103 C104 = CC0402_100NF_16V_10%_X5R: Non-polarised capacitor; Part Description: SMD Multilayer Chip Ceramic Capacitor; Manufacturer: GENERIC; Manufacturer1 Part Number: GRM155R61C104KA88D; Voltage: 16V; TC: X5R; Tolerance: ±10%; Part Number: CC0402_100NF_16V_10%_X5R; Component Kind: Standard; Component Type: Standard; Pin Count: 2; Value: 100nF; Status: None; Manufacturer Part Number: CC0402_100NF_16V_10%_X5R; Case: 0402; Mounted: Yes; Socket: No; SMD: Yes; Sense: No; Manufacturer1 Example: MURATA; Manufacturer1 ComponentHeight: 0.55mm; HelpURL: \\cern.ch\dfs\Applications\Altium\Datasheets\CC0402_X5R_MURATA_GRM.pdf; Author: CERN DEM JLC; CreateDate: 10.12.2013; LatestRevisionDate: 10.12.2013
C38 C91 C92 = CC0805_22UF_16V_10%_X5R: Non-polarised capacitor; Manufacturer: GENERIC; Part Description: SMD Multilayer Chip Ceramic Capacitor; Manufacturer1 Part Number: C2012X5R1C226KT; Tolerance: ±10%; Voltage: 16V; TC: X5R; Manufacturer Part Number: CC0805_22UF_16V_10%_X5R; Part Number: CC0805_22UF_16V_10%_X5R; Value: 22uF; Component Kind: Standard; Component Type: Standard; Pin Count: 2; Status: Preferred; Case: 0805; Mounted: Yes; Socket: No; SMD: Yes; Sense: No; Manufacturer1 Example: TDK; Manufacturer1 ComponentHeight: 1.35mm; HelpURL: \\cern.ch\dfs\Applications\Altium\Datasheets\CC0805_X5R_TDK_C.pdf; Author: CERN DEM JLC; CreateDate: 25.10.2012; LatestRevisionDate: 25.10.2012
C39 C43 C97 C98 C101 = CC0402_100NF_50V_10%_X7R: as C82 on sheet HV_DAC_1PPM; Part Number: CC0402_100NF_50V_10%_X7R; Component Kind: Standard; Component Type: Standard; Pin Count: 2; Value: 100nF; Status: None; Manufacturer Part Number: CC0402_100NF_50V_10%_X7R; Case: 0402; Mounted: Yes; Socket: No; SMD: Yes; Sense: No; Manufacturer1 Example: MURATA; Manufacturer1 ComponentHeight: 0.55mm; HelpURL: \\cern.ch\dfs\Applications\Altium\Datasheets\CC0402_MURATA_GRM155R71H104KE14D.pdf; Author: CERN DEM MR; CreateDate: 6/30/2017; LatestRevisionDate: 6/30/2017
C40 C93 C94 = CC0402_100PF_50V_5%_C0G: Non-polarised capacitor; Part Description: SMD Multilayer Chip Ceramic Capacitor; Manufacturer: GENERIC; Manufacturer1 Part Number: C0402C101J5GACTU; Voltage: 50V; TC: C0G/NP0; Tolerance: ±5%; Part Number: CC0402_100PF_50V_5%_C0G; Component Kind: Standard; Component Type: Standard; Pin Count: 2; Value: 100pF; Status: Preferred; Manufacturer Part Number: CC0402_100PF_50V_5%_C0G; Case: 0402; Mounted: Yes; Socket: No; SMD: Yes; Sense: No; Manufacturer1 Example: KEMET; Manufacturer1 ComponentHeight: 0.55mm; HelpURL: \\cern.ch\dfs\Applications\Altium\Datasheets\CC0402_C0G_KEMET_(Commercial Grade).pdf; Author: CERN DEM JLC; CreateDate: 03/12/2007; LatestRevisionDate: 22/04/2015
C41 = CC0402_1UF_16V_10%_X5R: as C45 on sheet ADC; Part Number: CC0402_1UF_16V_10%_X5R; Component Kind: Standard; Component Type: Standard; Pin Count: 2; Value: 1uF; Status: Preferred; Manufacturer Part Number: CC0402_1UF_16V_10%_X5R; Case: 0402; Mounted: Yes; Socket: No; SMD: Yes; Sense: No; Manufacturer1 Example: TDK; Manufacturer1 ComponentHeight: 0.55mm; HelpURL: \\cern.ch\dfs\Applications\Altium\Datasheets\CC0402_X5R_TDK_C.pdf; Author: CERN DEM JLC; CreateDate: 25.10.2012; LatestRevisionDate: 25.10.2012
D3 D8 D9 = DZ3X062D0L: Dual Common Anode Zener Diode; Part Description: Dual Common Anode Silicon Epitaxial Planar Diode; Manufacturer: PANASONIC; Voltage: 6.2V; Power: 200mA; PressFit: No; Bonding: No; Part Number: DZ3X062D0L; Component Kind: Standard; Component Type: Standard; Device: DZ3X062D0L; PackageDescription: SOT, 0.95mm Pitch; 3 Pin, 1.60mm W X 2.975mm L X 1.40mm H Body, IPC Medium Density; Manufacturer Part Number: DZ3X062D0L; Pin Count: 3; Case: SOT23-3; Mounted: Yes; Socket: No; SMD: Yes; Sense: No; ComponentHeight: 1.40mm; HelpURL: \\cern.ch\dfs\Applications\Altium\Datasheets\DZ3X062D0L.pdf; Author: CERN DEM JLC; CreateDate: 30/09/2014; LatestRevisionDate: 30/09/2014
IC8 = LM45CIM3/NOPB: -20° to +100°C ±3°C Precision Centigrade Temperature Sensors; Manufacturer: TEXAS INSTRUMENTS; PressFit: No; Bonding: No; Part Number: LM45CIM3/NOPB; Component Kind: Standard; Component Type: Standard; Device: LM45CIM3/NOPB; PackageDescription: SOT, 0.95mm Pitch; 3 Pin, 1.30mm W X 2.92mm L X 1.12mm H body, IPC Medium Density; Part Description: -20° to +100°C ±3°C Precision Centigrade Temperature Sensors; Manufacturer Part Number: LM45CIM3/NOPB; Pin Count: 3; Case: SOT23; Mounted: Yes; Socket: No; SMD: Yes; Sense: No; ComponentHeight: 1.12mm; HelpURL: \\cern.ch\dfs\Applications\Altium\Datasheets\LM45CIM3-NOPB.pdf; Author: CERN DEM JLC; CreateDate: 19/01/2011; LatestRevisionDate: 19/01/2011
IC9 = AD8676ARMZ: as IC14 on sheet DAC; Part Number: AD8676ARMZ; Component Kind: Standard; Component Type: Standard; Device: AD8676ARMZ; PackageDescription: SOP, 0.65mm Pitch; 8 Pin, 3.00mm W X 3.00mm L X 1.10mm H body, IPC Medium Density; Manufacturer Part Number: AD8676ARM; Pin Count: 8; Case: MSOP8; Mounted: Yes; Socket: No; SMD: Yes; Sense: No; ComponentHeight: 1.1mm; Author: CERN DEM JLC; HelpURL: \\cern.ch\dfs\Applications\Altium\Datasheets\AD8676ARMZ.pdf; CreateDate: 12/17/2013; LatestRevisionDate: 3/31/2022
IC17 = OPA207IDBVR: 2.2nV/sqrt Hz, Low-Power, 36-V Operational Amplifier; Manufacturer: TEXAS INSTRUMENTS; Part Number: OPA207IDBVR; Device: OPA207IDBVR; Component Kind: Standard; Component Type: Standard; PackageDescription: SOT, 0.95mm pitch; 5 pin, 1.60mm W X 2.90mm L X 1.45mm H body, IPC Medium Density; Part Description: 2.2nV/sqrt Hz, Low-Power, 36-V Operational Amplifier; Case: SOT 23-5; Manufacturer Part Number: OPA207IDBVR
L8 = IND0603_MURATA_BLM18PG471SN1D: Part Description: SMD EMIFIL Chip Ferrite Bead; Manufacturer: MURATA; Power: 1A; Resistance: 0.2R; Tolerance: ±25%; Part Number: IND0603_MURATA_BLM18PG471SN1D; Component Kind: Standard; Component Type: Standard; Pin Count: 2; Value: 470R@100MHz; Manufacturer Part Number: BLM18PG471SN1D; Case: 0603; Mounted: Yes; Socket: No; SMD: Yes; Sense: No; ComponentHeight: 0.95mm; HelpURL: \\cern.ch\dfs\Applications\Altium\Datasheets\IND0603_MURATA_BLM18P.pdf; Author: CERN DEM BC; CreateDate: 17.02.2021; LatestRevisionDate: 17.02.2021
P1 = TRIM_12T_100K_BOURNS_3224X-1-104E: Trimming Potentiometer; Part Description: 12 Turns SMD Trimpot® Trimming Potentiometer (Top Adjust); Manufacturer: BOURNS; Power: 0.25W; TC: ±100ppm/°C; Tolerance: ±10%; PressFit: No; Part Number: TRIM_12T_100K_BOURNS_3224X-1-104E; Component Kind: Standard; Component Type: Standard; Pin Count: 3; Value: 100k; Manufacturer Part Number: 3224X-1-104E; Case: 3224X; Mounted: Yes; Socket: No; SMD: Yes; Sense: No; ComponentHeight: 5.3mm; HelpURL: \\cern.ch\dfs\Applications\Altium\Datasheets\TRIM_BOURNS_3224X.pdf; Author: CERN DEM JLC; CreateDate: 12/18/2012; LatestRevisionDate: 12/18/2012
P2 P3 = TRIM_12T_10K_BOURNS_3224X-1-103E: Trimming Potentiometer; Part Description: 12 Turns SMD Trimpot® Trimming Potentiometer (Top Adjust); Manufacturer: BOURNS; Power: 0.25W; TC: ±100ppm/°C; Tolerance: ±10%; PressFit: No; Part Number: TRIM_12T_10K_BOURNS_3224X-1-103E; Component Kind: Standard; Component Type: Standard; Pin Count: 3; Value: 10k; Manufacturer Part Number: 3224X-1-103E; Case: 3224X; Mounted: Yes; Socket: No; SMD: Yes; Sense: No; ComponentHeight: 5.3mm; HelpURL: \\cern.ch\dfs\Applications\Altium\Datasheets\TRIM_BOURNS_3224X.pdf; Author: CERN DEM JLC; CreateDate: 12/18/2012; LatestRevisionDate: 12/18/2012
R33-R50 R52-R60 R65-R82 R84-R92 = R1206_68R_1%_0.25W_100PPM: Resistor - 1%; Part Description: General Purpose Thick Film Chip Resistor; Manufacturer: GENERIC; Manufacturer1 Part Number: NRC12F68R0TRF; Power: 0.25W; TC: ±100ppm/°C; PressFit: No; Part Number: R1206_68R_1%_0.25W_100PPM; Component Kind: Standard; Component Type: Standard; Pin Count: 2; Value: 68; Status: Preferred; Tolerance: ±1%; Manufacturer Part Number: R1206_68R_1%_0.25W_100PPM; Mounted: Yes; Sense: No; Socket: No; SMD: Yes; Manufacturer1 Example: NIC COMPONENT; Manufacturer1 ComponentHeight: 0.65mm; HelpURL: \\cern.ch\dfs\Applications\Altium\Datasheets\R1206_NIC_NRC.pdf; Author: CERN DEM JLC; CreateDate: 03/12/2007; LatestRevisionDate: 13/03/2008
R51 R135 R136 = R0805_10M_1%_0.125W_100PPM_VISHAY_CRCW e3: Resistor - 1%; Part Description: 150V, Standard Thick Film Chip Resistor; Manufacturer: VISHAY DALE; Manufacturer Part Number: CRCW080510M0FKEA; Power: 0.125W; TC: ±100ppm/°C; PressFit: No; Part Number: R0805_10M_1%_0.125W_100PPM_VISHAY_CRCW e3; Component Kind: Standard; Component Type: Standard; Pin Count: 2; Value: 10M; Status: None; Tolerance: ±1%; Case: 0805; Mounted: Yes; Sense: No; Socket: No; SMD: Yes; ComponentHeight: 0.5mm; HelpURL: \\cern.ch\dfs\Applications\Altium\Datasheets\R0805_VISHAY_CRCW e3.pdf; Author: CERN DEM BC; CreateDate: 2019-11-12; LatestRevisionDate: 2019-11-12
R61 R139 R141 = R0402_1k_1%_0.0625W_100PPM: Resistor - 1%; Part Description: General Purpose Thick Film Chip Resistor; Manufacturer: GENERIC; Manufacturer1 Part Number: 232270671002L; TC: ±100ppm/°C; PressFit: No; Part Number: R0402_1K_1%_0.0625W_100PPM; Component Kind: Standard; Component Type: Standard; Pin Count: 2; Value: 1k; Status: Not Recommended; Power: 0.0625W; Tolerance: ±1%; Manufacturer Part Number: R0402_1K_1%_0.0625W_100PPM; Case: 0402; Mounted: Yes; Sense: No; Socket: No; SMD: Yes; Manufacturer1 Example: YAGEO PHYCOMP; Manufacturer1 ComponentHeight: 0.4mm; HelpURL: \\cern.ch\dfs\Applications\Altium\Datasheets\R0402_Phycomp_RC0402.pdf; Author: CERN DEM JLC; CreateDate: 03.12.2007; LatestRevisionDate: 17.10.2012; ClassName: Artix
R62 R140 R142 = R0402_100K_1%_0.0625W_100PPM: as R94 on sheet ADC; Part Number: R0402_100K_1%_0.0625W_100PPM; Component Kind: Standard; Component Type: Standard; Pin Count: 2; Value: 100k; Status: Not Recommended; Power: 0.0625W; Tolerance: ±1%; Manufacturer Part Number: R0402_100K_1%_0.0625W_100PPM; Case: 0402; Mounted: Yes; Sense: No; Socket: No; SMD: Yes; Manufacturer1 Example: YAGEO PHYCOMP; Manufacturer1 ComponentHeight: 0.4mm; HelpURL: \\cern.ch\dfs\Applications\Altium\Datasheets\R0402_Phycomp_RC0402.pdf; Author: CERN DEM JLC; CreateDate: 03/12/2007; LatestRevisionDate: 17/10/2012
R63 R137 R138 R143-R146 = R0402_10K_1%_0.0625W_100PPM: as R108 on sheet DAC; Part Number: R0402_10K_1%_0.0625W_100PPM; Component Kind: Standard; Component Type: Standard; Pin Count: 2; Value: 10k; Status: Not Recommended; Power: 0.0625W; Manufacturer Part Number: R0402_10K_1%_0.0625W_100PPM; Case: 0402; Mounted: Yes; Sense: No; Socket: No; SMD: Yes; Manufacturer1 Example: YAGEO PHYCOMP; Manufacturer1 ComponentHeight: 0.4mm; HelpURL: \\cern.ch\dfs\Applications\Altium\Datasheets\R0402_Phycomp_RC0402.pdf; Author: CERN DEM JLC
  R63 R143 R144: Tolerance: ±1%; CreateDate: 03.12.2007; LatestRevisionDate: 17.10.2012
  R137 R138 R145 R146: CreateDate: 12/3/2007; LatestRevisionDate: 10/17/2012
R64 = R0402_75R_1%_0.0625W_100PPM: Resistor - 1%; Part Description: General Purpose Thick Film Chip Resistor; Manufacturer: GENERIC; Manufacturer1 Part Number: 232270677509L; TC: ±100ppm/°C; PressFit: No; Part Number: R0402_75R_1%_0.0625W_100PPM; Component Kind: Standard; Component Type: Standard; Pin Count: 2; Value: 75; Status: Not Recommended; Power: 0.0625W; Tolerance: ±1%; Manufacturer Part Number: R0402_75R_1%_0.0625W_100PPM; Case: 0402; Mounted: Yes; Sense: No; Socket: No; SMD: Yes; Manufacturer1 Example: YAGEO PHYCOMP; Manufacturer1 ComponentHeight: 0.4mm; HelpURL: \\cern.ch\dfs\Applications\Altium\Datasheets\R0402_Phycomp_RC0402.pdf; Author: CERN DEM JLC; CreateDate: 03/12/2007; LatestRevisionDate: 17/10/2012
R83 = R0402_7K5_1%_0.0625W_100PPM: Resistor - 1%; Part Description: General Purpose Thick Film Chip Resistor; Manufacturer: GENERIC; Manufacturer1 Part Number: 232270677502L; TC: ±100ppm/°C; PressFit: No; Part Number: R0402_7K5_1%_0.0625W_100PPM; Component Kind: Standard; Component Type: Standard; Pin Count: 2; Value: 7k5; Status: Not Recommended; Power: 0.0625W; Manufacturer Part Number: R0402_7K5_1%_0.0625W_100PPM; Case: 0402; Mounted: Yes; Sense: No; Socket: No; SMD: Yes; Manufacturer1 Example: YAGEO PHYCOMP; Manufacturer1 ComponentHeight: 0.4mm; HelpURL: \\cern.ch\dfs\Applications\Altium\Datasheets\R0402_Phycomp_RC0402.pdf; Author: CERN DEM JLC; CreateDate: 03.12.2007; LatestRevisionDate: 17.10.2012
R93 = R0402_4K7_1%_0.0625W_100PPM: Resistor - 1%; Part Description: General Purpose Thick Film Chip Resistor; Manufacturer: GENERIC; Manufacturer1 Part Number: 232270674702L; TC: ±100ppm/°C; PressFit: No; Part Number: R0402_4K7_1%_0.0625W_100PPM; Component Kind: Standard; Component Type: Standard; Pin Count: 2; Value: 4k7; Status: Not Recommended; Power: 0.0625W; Manufacturer Part Number: R0402_4K7_1%_0.0625W_100PPM; Case: 0402; Mounted: Yes; Sense: No; Socket: No; SMD: Yes; Manufacturer1 Example: YAGEO PHYCOMP; Manufacturer1 ComponentHeight: 0.4mm; HelpURL: \\cern.ch\dfs\Applications\Altium\Datasheets\R0402_Phycomp_RC0402.pdf; Author: CERN DEM JLC; CreateDate: 03.12.2007; LatestRevisionDate: 17.10.2012
T4-T12 = BSH103: N-CHANNEL MOSFET WITH DIODE; Part Description: 30V 850mA N-Channel Enhancement Mode Field-Effect Transistor; Manufacturer: NEXPERIA; PressFit: No; Bonding: No; Part Number: BSH103; Component Kind: Standard; Component Type: Standard; Device: BSH103; PackageDescription: SOT23, 3 pin, Pitch 0.95mm - 1.3mm W X 2.9mm L X 1.1mm H, IPC Medium Density; Manufacturer Part Number: BSH103; Pin Count: 3; Case: SOT23-3; Mounted: Yes; Socket: No; SMD: Yes; Sense: No; ComponentHeight: 1.1mm; HelpURL: \\cern.ch\dfs\Applications\Altium\Datasheets\BSH103.pdf; Author: CERN DEM JLC; CreateDate: 16.03.2010; LatestRevisionDate: 20.06.2017
TP2 TP3 = SMD_PAD_1.27X1.27MM: Part Description: 1.27mm x 1.27mm PCB Copper Area (SMD Test Point); Mounted: No; Part Number: SMD_PAD_1.27X1.27MM; Component Type: Standard (No BOM); Pin Count: 1; Family: Test Point; Socket: No; SMD: Yes; Sense: No; Status: None; ComponentHeight: 0mm; HelpURL: Undefined; Author: CERN DEM JLC; CreateDate: 12.01.2008; LatestRevisionDate: 12.01.2008; PackageDescription: 1.27mm x 1.27mm PCB Copper Area (SMD Test Point)